# EAGLE board glassesBoard (EAGLE 9.2.2), part 1 of 2
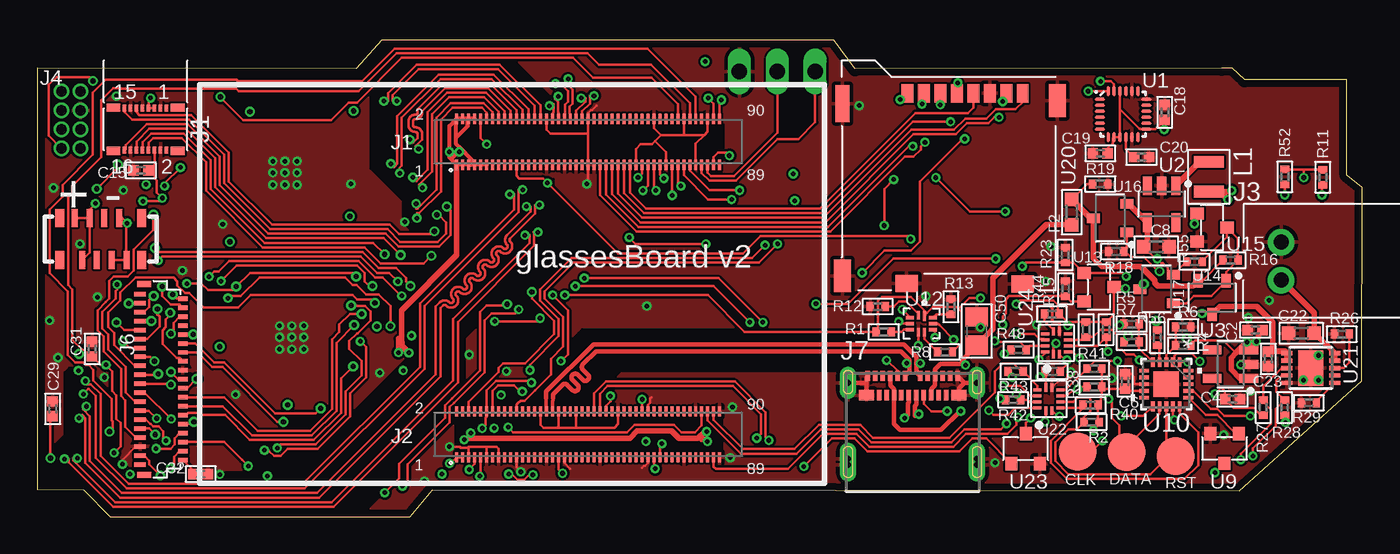
[diagram p2: board, top side]
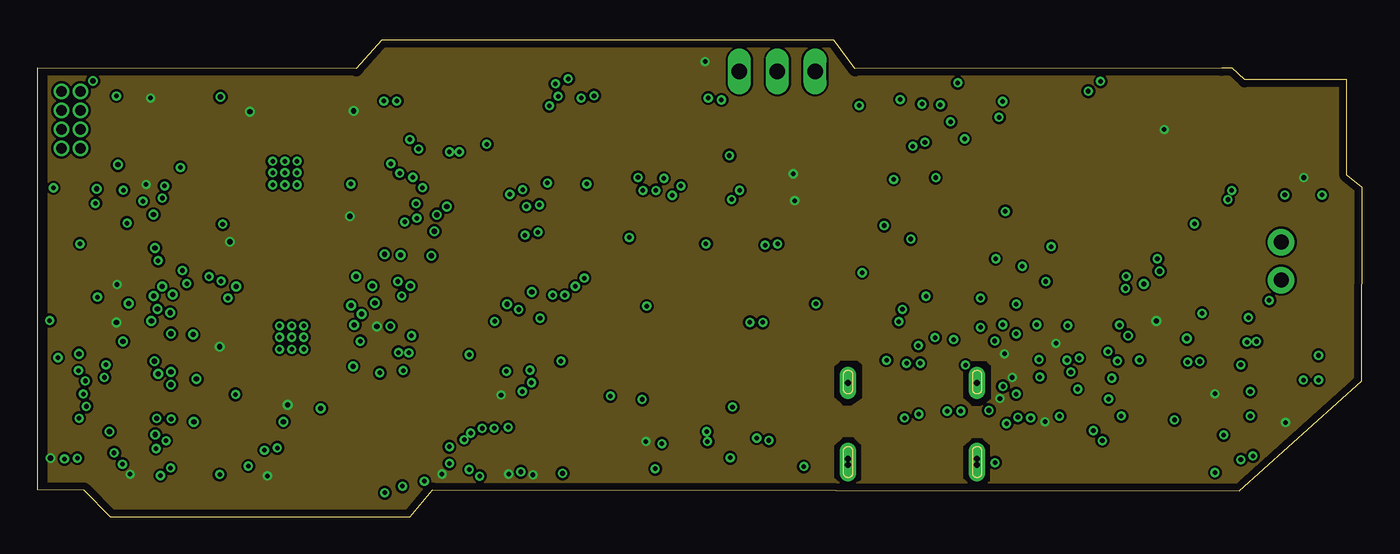
[diagram p3: board, inner layer Route2]
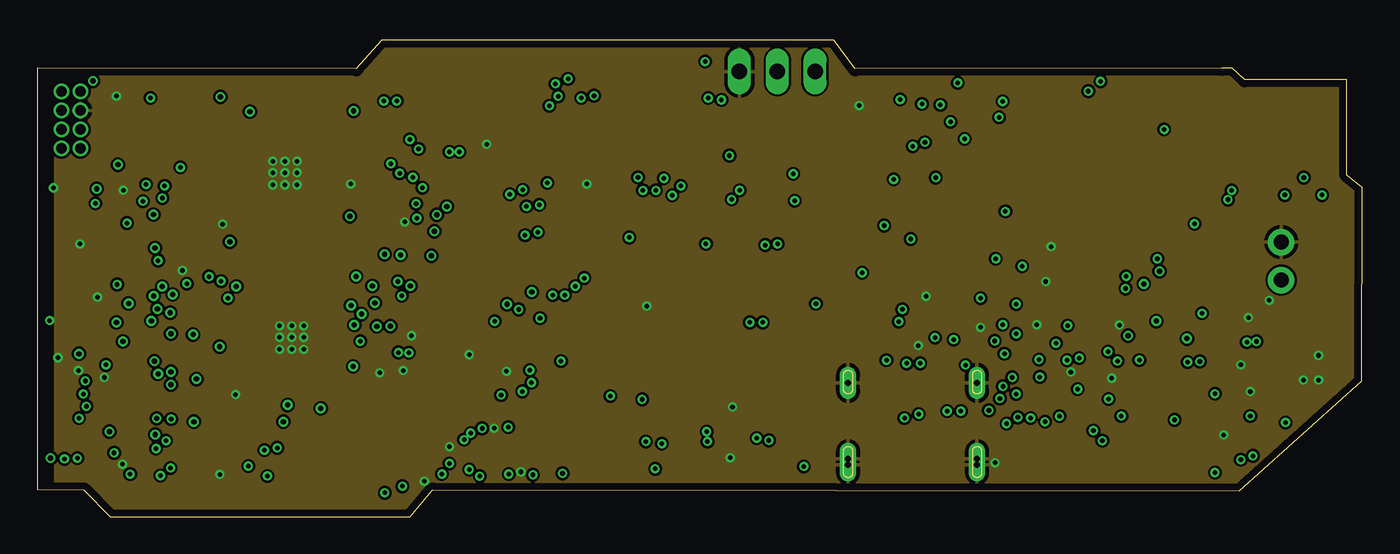
[diagram p4: board, inner layer Route15]
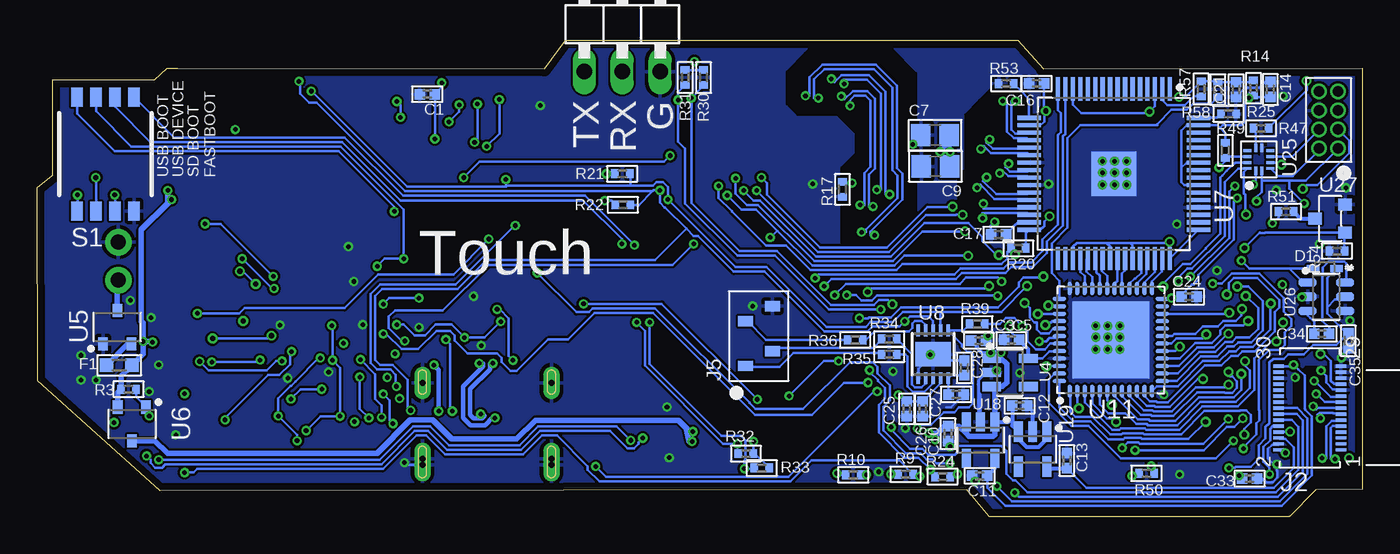
[diagram p5: board, bottom side, seen from below]

Size 88.71 x 31.93 mm. Coordinates in mm from the lower left corner, seen from the top.
Outline: 0,1.83 3.11,1.78 4.89,0 24.96,0 26.48,1.78 80.47,1.73 88.69,9.1 88.71,22.03 87.69,22.86 87.69,29.26 80.84,29.26 80.02,30.02 79.29,30.02 54.75,30 53.33,31.93 23.05,31.93 21.35,30 0,30.02 0,1.83
Copper layers (1*2*15*16): Top 0.035mm / dielectric 0.2mm / Route2 0.035mm / dielectric 1.2mm / Route15 0.035mm / dielectric 0.2mm / Bottom 0.035mm
Design rules "Elecrow_4-layer_PCB_eagle_rule": minimum track width 6mil, minimum drill 12mil, track to track 6mil, track to pad 6mil, pad to pad 6mil, via to via 8mil, smd to smd 0mil, copper to edge 20mil, drill to drill 10mil, minimum pad ring 6mil, minimum via ring 6mil, stop-mask expansion 0mil, vias tented up to drill 100mil, thermal gap 10mil
Net classes: 1 wide_diff_pair: width 0.127 mm, drill 0.305 mm, clearance 0.127 mm

## Footprints (pad centres in the part's own frame; a part is rotated, then mirrored left to right if it is on the bottom)
C0402 = smd 0.7 x 0.7: 1 -0.5,0; 2 0.5,0
C0805 = smd 1.3 x 1.5: 1 -0.95,0; 2 0.95,0
C0603 = smd 0.9 x 0.9: 1 -0.85,0; 2 0.85,0
SOD1608X70 = smd 0.86 x 0.46: A 0.785,0; C -0.785,0
R0603 = smd 0.9 x 0.9: 1 -0.85,0; 2 0.85,0
BM10NB(0.8)-16DS-0.4V(51) = smd 0.23 x 0.47: 1 -1.4,-1.405; 2 -1.4,1.405; 3 -1,-1.405; 4 -1,1.405; 5 -0.6,-1.405; 6 -0.6,1.405; 7 -0.2,-1.405; 8 -0.2,1.405; 9 0.2,-1.405; 10 0.2,1.405; 11 0.6,-1.405; 12 0.6,1.405; 13 1,-1.405; 14 1,1.405; 15 1.4,-1.405; 16 1.4,1.405 | smd 0.92 x 0.55: 17 -2.15,1.445; 18 2.15,1.445; 19 -2.15,-1.445; 20 2.15,-1.445
DF30FC-30DS-0.4V = smd 0.23 x 0.7: 1 2.8,2.08; 2 2.8,-2.08; 3 2.4,2.08; 4 2.4,-2.08; 5 2,2.08; 6 2,-2.08; 7 1.6,2.08; 8 1.6,-2.08; 9 1.2,2.08; 10 1.2,-2.08; 11 0.8,2.08; 12 0.8,-2.08; 13 0.4,2.08; 14 0.4,-2.08; 15 0,2.08; 16 0,-2.08; 17 -0.4,2.08; 18 -0.4,-2.08; 19 -0.8,2.08; 20 -0.8,-2.08; 21 -1.2,2.08; 22 -1.2,-2.08; 23 -1.6,2.08; 24 -1.6,-2.08; 25 -2,2.08; 26 -2,-2.08; 27 -2.4,2.08; 28 -2.4,-2.08; 29 -2.8,2.08; 30 -2.8,-2.08
S2B-XH-A(LF)(SN) = drill 1 pad 1.778: 1 0,1.27; 2 0,-1.27
GRPB042MWCN-RC = drill 0.7 pad 0.991: 1 -1.905,-0.635; 2 -0.635,-0.635; 3 0.635,-0.635; 4 1.905,-0.635; 5 1.905,0.635; 6 0.635,0.635; 7 -0.635,0.635; 8 -1.905,0.635
0787324001 = smd 0.7 x 1: 1 -2,0.9; 2 -1,-0.9; 3 1,0.9; 4 2,-0.9
FH26W-39S-0.3SHW = smd 0.3 x 0.8: 1 -5.7,0; 3 -5.1,0; 5 -4.5,0; 7 -3.9,0; 9 -3.3,0; 11 -2.7,0; 13 -2.1,0; 15 -1.5,0; 17 -0.9,0; 19 -0.3,0; 21 0.3,0; 23 0.9,0; 25 1.5,0; 27 2.1,0; 29 2.7,0; 31 3.3,0; 33 3.9,0; 35 4.5,0; 37 5.1,0; 39 5.7,0 | smd 0.3 x 0.65: 2 -5.4,2.875; 4 -4.8,2.875; 6 -4.2,2.875; 8 -3.6,2.875; 10 -3,2.875; 12 -2.4,2.875; 14 -1.8,2.875; 16 -1.2,2.875; 18 -0.6,2.875; 20 0,2.875; 22 0.6,2.875; 24 1.2,2.875; 26 1.8,2.875; 28 2.4,2.875; 30 3,2.875; 32 3.6,2.875; 34 4.2,2.875; 36 4.8,2.875; 38 5.4,2.875 | smd 0.4 x 0.95: P$21 -6.4,0.275; P$22 6.4,0.275
MOLEX_105450-0101 = smd 0.3 x 0.7: A1 -3,3.77; A2 -2.5,3.77; A3 -2,3.77; A4 -1.5,3.77; A5 -1,3.77; A6 -0.5,3.77; A7 0.5,3.77; A8 1,3.77; A9 1.5,3.77; A10 2,3.77; A11 2.5,3.77; A12 3,3.77; B2 2.25,2.47; B3 1.75,2.47; B4 1.25,2.47; B5 0.75,2.47; B6 0.25,2.47; B7 -0.25,2.47; B8 -0.75,2.47; B9 -1.25,2.47; B10 -1.75,2.47; B11 -2.25,2.47 | smd 1 x 0.7: B1 3.1,2.47; B12 -3.1,2.47 | drill 0.4 pad 1.1 long: P$1 -4.32,3.3; P$2 -4.32,-2.2; P$3 -4.32,-1.8; P$4 4.32,3.3; P$5 4.32,-2.2; P$6 4.32,-1.8
62674-081121ALF = smd 0.4 x 1.2: 1 2.5,-1.4; 2 2,1.4; 3 1.5,-1.4; 4 1,1.4; 5 0.5,-1.4; 6 0,1.4; 7 -0.5,-1.4; 8 -1,1.4 | smd 0.6 x 1.2: P$9 -2,1.4; P$10 -2,-1.4; P$11 3.5,-1.4; P$12 3.5,1.4
1X03/90 = drill 1.016 long: 1 -2.54,-3.81; 2 0,-3.81; 3 2.54,-3.81
1008 = smd 0.8 x 2: P$1 -1,0; P$2 1,0
R0402 = smd 0.5 x 0.6: 1 -0.5,0; 2 0.5,0
218-4LPST = smd 0.76 x 1.27: 1 -1.905,-3.81; 2 -1.905,3.81; 3 -0.635,-3.81; 4 -0.635,3.81; 5 0.635,-3.81; 6 0.635,3.81; 7 1.905,-3.81; 8 1.905,3.81
B2,54 = smd 2.54 x 2.54: TP 0,0
QFN40P300X300X105-25N = smd 0.7 x 0.2: 1 -1.55,1; 2 -1.55,0.6; 3 -1.55,0.2; 4 -1.55,-0.2; 5 -1.55,-0.6; 6 -1.55,-1; 13 1.55,-1; 14 1.55,-0.6; 15 1.55,-0.2; 16 1.55,0.2; 17 1.55,0.6; 18 1.55,1 | smd 0.2 x 0.7: 7 -1,-1.55; 8 -0.6,-1.55; 9 -0.2,-1.55; 10 0.2,-1.55; 11 0.6,-1.55; 12 1,-1.55; 19 1,1.55; 20 0.6,1.55; 21 0.2,1.55; 22 -0.2,1.55; 23 -0.6,1.55; 24 -1,1.55
SOT23-5 = smd 1.259 x 0.609: 1 -1.228,0.95; 2 -1.228,0; 3 -1.228,-0.95; 4 1.228,-0.95; 5 1.228,0.95
SOTFL95P240X80-3 = smd 0.878 x 0.641: 1 -1.125,0.95; 2 -1.125,-0.95; 3 1.125,0
QFP50P1200X1200X120-65T300 = smd 1.559 x 0.28: 1 -5.678,3.75; 2 -5.678,3.25; 3 -5.678,2.75; 4 -5.678,2.25; 5 -5.678,1.75; 6 -5.678,1.25; 7 -5.678,0.75; 8 -5.678,0.25; 9 -5.678,-0.25; 10 -5.678,-0.75; 11 -5.678,-1.25; 12 -5.678,-1.75; 13 -5.678,-2.25; 14 -5.678,-2.75; 15 -5.678,-3.25; 16 -5.678,-3.75; 33 5.678,-3.75; 34 5.678,-3.25; 35 5.678,-2.75; 36 5.678,-2.25; 37 5.678,-1.75; 38 5.678,-1.25; 39 5.678,-0.75; 40 5.678,-0.25; 41 5.678,0.25; 42 5.678,0.75; 43 5.678,1.25; 44 5.678,1.75; 45 5.678,2.25; 46 5.678,2.75; 47 5.678,3.25; 48 5.678,3.75 | smd 0.28 x 1.559: 17 -3.75,-5.678; 18 -3.25,-5.678; 19 -2.75,-5.678; 20 -2.25,-5.678; 21 -1.75,-5.678; 22 -1.25,-5.678; 23 -0.75,-5.678; 24 -0.25,-5.678; 25 0.25,-5.678; 26 0.75,-5.678; 27 1.25,-5.678; 28 1.75,-5.678; 29 2.25,-5.678; 30 2.75,-5.678; 31 3.25,-5.678; 32 3.75,-5.678; 49 3.75,5.678; 50 3.25,5.678; 51 2.75,5.678; 52 2.25,5.678; 53 1.75,5.678; 54 1.25,5.678; 55 0.75,5.678; 56 0.25,5.678; 57 -0.25,5.678; 58 -0.75,5.678; 59 -1.25,5.678; 60 -1.75,5.678; 61 -2.25,5.678; 62 -2.75,5.678; 63 -3.25,5.678; 64 -3.75,5.678 | smd 3 x 3: 65 0,0
DFN10-3X3 = smd 0.8 x 0.3: 1 -1.6,1; 2 -1.6,0.5; 3 -1.6,0; 4 -1.6,-0.5; 5 -1.6,-1; 6 1.6,-1; 7 1.6,-0.5; 8 1.6,0; 9 1.6,0.5; 10 1.6,1 | smd 1.65 x 2.38: EXP 0,0
SOT-23_(TO-236AB) = smd 0.8 x 0.9: D 0,-1; G 0.95,1; S -0.95,1
20M2 = smd 0.66 x 0.254: 1 -1.477,0.9; 2 -1.477,0.45; 3 -1.477,0; 4 -1.477,-0.45; 5 -1.477,-0.9; 11 1.477,-0.9; 12 1.477,-0.45; 13 1.477,0; 14 1.477,0.45; 15 1.477,0.9 | smd 0.254 x 0.66: 6 -0.9,-1.477; 7 -0.45,-1.477; 8 0,-1.477; 9 0.45,-1.477; 10 0.9,-1.477; 16 0.9,1.477; 17 0.45,1.477; 18 0,1.477; 19 -0.45,1.477; 20 -0.9,1.477 | smd 1.7 x 1.7: 21 0,0
QFN50P700X700X100-49T515 = smd 0.896 x 0.27: 1 -3.437,2.75; 2 -3.437,2.25; 3 -3.437,1.75; 4 -3.437,1.25; 5 -3.437,0.75; 6 -3.437,0.25; 7 -3.437,-0.25; 8 -3.437,-0.75; 9 -3.437,-1.25; 10 -3.437,-1.75; 11 -3.437,-2.25; 12 -3.437,-2.75; 25 3.437,-2.75; 26 3.437,-2.25; 27 3.437,-1.75; 28 3.437,-1.25; 29 3.437,-0.75; 30 3.437,-0.25; 31 3.437,0.25; 32 3.437,0.75; 33 3.437,1.25; 34 3.437,1.75; 35 3.437,2.25; 36 3.437,2.75 | smd 0.27 x 0.896: 13 -2.75,-3.437; 14 -2.25,-3.437; 15 -1.75,-3.437; 16 -1.25,-3.437; 17 -0.75,-3.437; 18 -0.25,-3.437; 19 0.25,-3.437; 20 0.75,-3.437; 21 1.25,-3.437; 22 1.75,-3.437; 23 2.25,-3.437; 24 2.75,-3.437; 37 2.75,3.437; 38 2.25,3.437; 39 1.75,3.437; 40 1.25,3.437; 41 0.75,3.437; 42 0.25,3.437; 43 -0.25,3.437; 44 -0.75,3.437; 45 -1.25,3.437; 46 -1.75,3.437; 47 -2.25,3.437; 48 -2.75,3.437 | smd 5.15 x 5.15: 49 0,0
UQFN10 = smd 0.663 x 0.225: 1 -0.518,0.2 | smd 0.563 x 0.225: 2 -0.569,-0.2; 6 0.569,-0.2; 7 0.569,0.2 | smd 0.225 x 0.563: 3 -0.4,-0.768; 4 0,-0.768; 5 0.4,-0.768; 8 0.4,0.768; 9 0,0.768; 10 -0.4,0.768
SOT95P275X130-5 = smd 1.38 x 0.589: 1 -1.166,0.95; 2 -1.166,0; 3 -1.166,-0.95; 4 1.166,-0.95; 5 1.166,0.95
MICROSD = smd 0.8 x 1.24: 1 -4.4,0; 2 -3.3,0; 3 -2.2,0; 4 -1.1,0; 5 0,0; 6 1.1,0; 7 2.2,0; 8 3.3,0 | smd 0.95 x 2.5: 9 -8.775,-0.7 | smd 1.15 x 2.2: 10 5.615,-0.5; 11 -8.775,-12.23 | smd 1.5 x 1.15: 12 -4.47,-12.755; 13 3.31,-12.775
12MLP = smd 0.563 x 0.2: 1 -0.768,0.2; 2 -0.768,-0.2; 7 0.768,-0.2; 8 0.768,0.2 | smd 0.2 x 0.563: 3 -0.6,-0.768; 4 -0.2,-0.768; 5 0.2,-0.768; 6 0.6,-0.768; 9 0.6,0.768; 10 0.2,0.768; 11 -0.2,0.768; 12 -0.6,0.768
SOT95P280X145-6 = smd 1.209 x 0.584: 1 -1.253,0.95; 2 -1.253,0; 3 -1.253,-0.95; 4 1.253,-0.95; 5 1.253,0; 6 1.253,0.95
DART-SD410 = smd 0.2 x 0.7: J1.1 8.8,-18.02; J1.2 8.8,-21.1; J1.3 8.4,-18.02; J1.4 8.4,-21.1; J1.5 8,-18.02; J1.6 8,-21.1; J1.7 7.6,-18.02; J1.8 7.6,-21.1; J1.9 7.2,-18.02; J1.10 7.2,-21.1; J1.11 6.8,-18.02; J1.12 6.8,-21.1; J1.13 6.4,-18.02; J1.14 6.4,-21.1; J1.15 6,-18.02; J1.16 6,-21.1; J1.17 5.6,-18.02; J1.18 5.6,-21.1; J1.19 5.2,-18.02; J1.20 5.2,-21.1; J1.21 4.8,-18.02; J1.22 4.8,-21.1; J1.23 4.4,-18.02; J1.24 4.4,-21.1; J1.25 4,-18.02; J1.26 4,-21.1; J1.27 3.6,-18.02; J1.28 3.6,-21.1; J1.29 3.2,-18.02; J1.30 3.2,-21.1; J1.31 2.8,-18.02; J1.32 2.8,-21.1; J1.33 2.4,-18.02; J1.34 2.4,-21.1; J1.35 2,-18.02; J1.36 2,-21.1; J1.37 1.6,-18.02; J1.38 1.6,-21.1; J1.39 1.2,-18.02; J1.40 1.2,-21.1; J1.41 0.8,-18.02; J1.42 0.8,-21.1; J1.43 0.4,-18.02; J1.44 0.4,-21.1; J1.45 0,-18.02; J1.46 0,-21.1; J1.47 -0.4,-18.02; J1.48 -0.4,-21.1; J1.49 -0.8,-18.02; J1.50 -0.8,-21.1; J1.51 -1.2,-18.02; J1.52 -1.2,-21.1; J1.53 -1.6,-18.02; J1.54 -1.6,-21.1; J1.55 -2,-18.02; J1.56 -2,-21.1; J1.57 -2.4,-18.02; J1.58 -2.4,-21.1; J1.59 -2.8,-18.02; J1.60 -2.8,-21.1; J1.61 -3.2,-18.02; J1.62 -3.2,-21.1; J1.63 -3.6,-18.02; J1.64 -3.6,-21.1; J1.65 -4,-18.02; J1.66 -4,-21.1; J1.67 -4.4,-18.02; J1.68 -4.4,-21.1; J1.69 -4.8,-18.02; J1.70 -4.8,-21.1; J1.71 -5.2,-18.02; J1.72 -5.2,-21.1; J1.73 -5.6,-18.02; J1.74 -5.6,-21.1; J1.75 -6,-18.02; J1.76 -6,-21.1; J1.77 -6.4,-18.02; J1.78 -6.4,-21.1; J1.79 -6.8,-18.02; J1.80 -6.8,-21.1; J1.81 -7.2,-18.02; J1.82 -7.2,-21.1; J1.83 -7.6,-18.02; J1.84 -7.6,-21.1; J1.85 -8,-18.02; J1.86 -8,-21.1; J1.87 -8.4,-18.02; J1.88 -8.4,-21.1; J1.89 -8.8,-18.02; J1.90 -8.8,-21.1; J2.1 8.8,1.58; J2.2 8.8,-1.5; J2.3 8.4,1.58; J2.4 8.4,-1.5; J2.5 8,1.58; J2.6 8,-1.5; J2.7 7.6,1.58; J2.8 7.6,-1.5; J2.9 7.2,1.58; J2.10 7.2,-1.5; J2.11 6.8,1.58; J2.12 6.8,-1.5; J2.13 6.4,1.58; J2.14 6.4,-1.5; J2.15 6,1.58; J2.16 6,-1.5; J2.17 5.6,1.58; J2.18 5.6,-1.5; J2.19 5.2,1.58; J2.20 5.2,-1.5; J2.21 4.8,1.58; J2.22 4.8,-1.5; J2.23 4.4,1.58; J2.24 4.4,-1.5; J2.25 4,1.58; J2.26 4,-1.5; J2.27 3.6,1.58; J2.28 3.6,-1.5; J2.29 3.2,1.58; J2.30 3.2,-1.5; J2.31 2.8,1.58; J2.32 2.8,-1.5; J2.33 2.4,1.58; J2.34 2.4,-1.5; J2.35 2,1.58; J2.36 2,-1.5; J2.37 1.6,1.58; J2.38 1.6,-1.5; J2.39 1.2,1.58; J2.40 1.2,-1.5; J2.41 0.8,1.58; J2.42 0.8,-1.5; J2.43 0.4,1.58; J2.44 0.4,-1.5; J2.45 0,1.58; J2.46 0,-1.5; J2.47 -0.4,1.58; J2.48 -0.4,-1.5; J2.49 -0.8,1.58; J2.50 -0.8,-1.5; J2.51 -1.2,1.58; J2.52 -1.2,-1.5; J2.53 -1.6,1.58; J2.54 -1.6,-1.5; J2.55 -2,1.58; J2.56 -2,-1.5; J2.57 -2.4,1.58; J2.58 -2.4,-1.5; J2.59 -2.8,1.58; J2.60 -2.8,-1.5; J2.61 -3.2,1.58; J2.62 -3.2,-1.5; J2.63 -3.6,1.58; J2.64 -3.6,-1.5; J2.65 -4,1.58; J2.66 -4,-1.5; J2.67 -4.4,1.58; J2.68 -4.4,-1.5; J2.69 -4.8,1.58; J2.70 -4.8,-1.5; J2.71 -5.2,1.58; J2.72 -5.2,-1.5; J2.73 -5.6,1.58; J2.74 -5.6,-1.5; J2.75 -6,1.58; J2.76 -6,-1.5; J2.77 -6.4,1.58; J2.78 -6.4,-1.5; J2.79 -6.8,1.58; J2.80 -6.8,-1.5; J2.81 -7.2,1.58; J2.82 -7.2,-1.5; J2.83 -7.6,1.58; J2.84 -7.6,-1.5; J2.85 -8,1.58; J2.86 -8,-1.5; J2.87 -8.4,1.58; J2.88 -8.4,-1.5; J2.89 -8.8,1.58; J2.90 -8.8,-1.5

## Placement (x,y rotation side)
C1  1uF  [C0402]  62.6,28.3 180 bottom
C2  1uF  [C0402]  81.55,12.5 180 top
C3  1uF  [C0402]  25.67,11.79 0 bottom
C4  1uF  [C0402]  80.02,7.87 0 top
C5  1uF  [C0402]  23.48,11.84 180 bottom
C6  1uF  [C0402]  72.84,9.05 90 top
C7  22uF  [C0805]  28.6,25.55 0 bottom
C8  10uF  [C0603]  74.92,18.07 0 top
C9  22uF  [C0805]  28.58,23.46 180 bottom
C10  1uF  [C0402]  27.73,5.55 270 bottom
C11  1uF  [C0402]  25.6,2.73 180 bottom
C12  1uF  [C0402]  22.94,7.42 0 bottom
C13  1uF  [C0402]  19.77,3.75 90 bottom
C14  1uF  [C0402]  6.15,28.61 90 bottom
C15  1uF  [C0402]  6.93,23.19 0 top
C16  1uF  [C0402]  21.81,29.01 180 bottom
C17  1uF  [C0402]  24.35,18.9 180 bottom
C18  100nF  [C0402]  75.49,27.08 90 top
C19  100nF  [C0402]  71.18,24.33 180 top
C20  100nF  [C0402]  73.93,24.08 0 top
C21  1uF  [C0402]  8.45,28.6 270 bottom
C22  10uF  [C0603]  84.64,12.28 180 top
C23  1uF  [C0402]  82.42,10.56 270 top
C24  1uF  [C0402]  11.6,14.73 0 bottom
C25  1uF  [C0402]  30.49,7.21 270 bottom
C26  100nF  [C0402]  29.43,7.21 270 bottom
C27  1uF  [C0402]  27.19,8.18 0 bottom
C28  100nF  [C0402]  26.63,9.96 90 bottom
C29  1uF  [C0402]  1.03,7.21 90 top
C31  1uF  [C0402]  3.67,11.23 90 top
C32  100nF  [C0402]  10.94,2.84 0 top
C33  100nF  [C0402]  7.53,2.54 0 bottom
C34  1uF  [C0402]  2.71,12.24 180 bottom
C35  1uF  [C0402]  0.93,11.79 270 bottom
C50  22uF  [C0805]  62.9,12.42 90 top
D1  SDM03U40-7SC79  [SOD1608X70]  2.5,16.61 180 bottom
F1  SF-0603S200-2  [R0603]  83.22,10.14 0 bottom
F2  SF-0603S200-2  [R0603]  69.26,20.4 90 top
J1  BM10NB(0.8)-16DS-0.4V(51)  [BM10NB(0.8)-16DS-0.4V(51)]  7.25,25.95 180 top
J2  DF30FC-30DS-0.4V  [DF30FC-30DS-0.4V]  3.51,7.27 270 bottom
J3  S2B-XH-A(LF)(SN)  [S2B-XH-A(LF)(SN)]  83.29,17.11 180 top
J4  GRPB042MWCN-RC  [GRPB042MWCN-RC]  2.25,26.57 90 bottom
J5  0787324001  [0787324001]  40.4,12.09 90 bottom
J6  FH26W-39S-0.3SHW  [FH26W-39S-0.3SHW]  6.87,9.19 270 top
J7  105450-0101  [MOLEX_105450-0101]  58.61,5.65 0 top
J8  62674-081121ALF  [62674-081121ALF]  4.99,18.59 180 top
JP1  [1X03/90]  49.54,33.63 0 bottom
L1  4.7uH  [1008]  78.44,22.76 270 top
R1  56k  [R0402]  56.68,12.37 180 top
R2  10k  [R0402]  70.58,6.33 180 top
R3  10k  [R0402]  82.6,8.53 0 bottom
R4  2.15k  [R0402]  76.73,11.47 0 top
R5  1k  [R0402]  73.26,12.9 180 top
R6  3.2k  [R0402]  76.73,12.7 0 top
R7  3.2k  [R0402]  73.27,11.69 0 top
R8  56k  [R0402]  60.77,11.02 0 top
R9  10k  [R0402]  30.57,2.84 180 bottom
R10  10k  [R0402]  34.07,2.79 0 bottom
R11  10k  [R0402]  86.07,22.73 90 top
R12  5.1k  [R0402]  56.27,14.06 0 top
R13  5.1k  [R0402]  61.17,14.05 270 top
R14  10k  [R0402]  7.28,28.7 90 bottom
R15  10k  [R0402]  68.85,15.26 270 top
R16  10k  [R0402]  79.89,17.17 180 top
R17  10k  [R0402]  34.8,21.92 90 bottom
R18  10k  [R0402]  72.24,17.76 0 top
R19  10k  [R0402]  71.17,22.28 0 top
R20  10k  [R0402]  23.02,17.97 0 bottom
R21  5.1k  [R0402]  49.55,22.96 180 bottom
R22  5.1k  [R0402]  49.5,20.88 180 bottom
R23  10k  [R0402]  68.82,17.52 270 top
R24  10k  [R0402]  28.1,2.68 0 bottom
R25  10k  [R0402]  8.95,26.97 180 bottom
R26  10k  [R0402]  87.35,12.22 0 top
R27  10k  [R0402]  82.08,7.31 270 top
R28  10k  [R0402]  83.52,7.31 270 top
R29  2k  [R0402]  85.14,7.62 0 top
R30  5.1k  [R0402]  44.11,29.41 90 bottom
R31  5.1k  [R0402]  45.33,29.41 90 bottom
R32  5.1k  [R0402]  41.26,4.22 0 bottom
R33  5.1k  [R0402]  40.2,3.25 0 bottom
R34  470R  [R0402]  31.66,11.89 180 bottom
R35  470R  [R0402]  31.66,10.87 180 bottom
R36  470R  [R0402]  33.95,11.84 180 bottom
R37  10k  [R0402]  67.98,9.73 0 top
R38  5.1k  [R0402]  70.78,8.69 0 top
R39  5.1k  [R0402]  25.77,12.9 0 bottom
R40  5.1k  [R0402]  70.52,7.47 0 top
R41  10k  [R0402]  70.78,9.91 0 top
R42  10k  [R0402]  65.34,7.82 180 top
R43  10k  [R0402]  65.49,9.73 180 top
R44  10k  [R0402]  67.93,13.56 0 top
R45  10k  [R0402]  70.22,12.52 90 top
R46  10k  [R0402]  71.56,12.52 90 top
R47  10k  [R0402]  6.77,26.01 0 bottom
R48  10k  [R0402]  65.7,11.18 180 top
R49  10k  [R0402]  9.16,24.54 90 bottom
R50  10k  [R0402]  14.44,2.9 180 bottom
R51  8R  [R0402]  5.09,20.42 180 bottom
R52  10k  [R0402]  83.53,22.76 90 top
R53  10k  [R0402]  23.84,29.01 0 bottom
R54  10k  [R0402]  1.69,17.78 0 bottom
R55  10k  [R0402]  77.48,17.07 180 top
R56  10k  [R0402]  74.99,11.99 90 top
R57  0R  [R0402]  10.78,28.65 270 bottom
R58  0R  [R0402]  9.67,28.6 270 bottom
S1  218-4LPST  [218-4LPST]  84.14,24.28 0 bottom
TP1  TPB2,54  [B2,54]  69.67,4.34 0 top
TP2  TPB2,54  [B2,54]  72.92,4.32 0 top
TP3  TPB2,54  [B2,54]  76.22,4.05 0 top
U1  [QFN40P300X300X105-25N]  72.7,26.95 0 top
U2  TPS613222A  [SOT23-5]  75.28,20.93 270 top
U3  1.8  [SOT23-5]  79.88,10.2 180 top
U4  3.3  [SOT23-5]  23.58,9.65 0 bottom
U5  SSM3J338RSOT-23F  [SOTFL95P240X80-3]  83.36,12.69 90 bottom
U6  SSM3J338RSOT-23F  [SOTFL95P240X80-3]  82.38,6.2 270 bottom
U7  SN65DSI83-Q1S-PQFP-G64  [QFP50P1200X1200X120-65T300]  16.62,22.96 270 bottom
U8  IQS263BDFN10  [DFN10-3X3]  28.73,10.88 90 bottom
U9  NX3020NAK  [SOT-23_(TO-236AB)]  79.49,4.57 0 top
U10  ATTINY20-MMH  [20M2]  75.59,8.87 270 top
U11  SN65LVDS822VQFN48  [QFN50P700X700X100-49T515]  16.83,11.84 90 bottom
U12  NLAS2750  [UQFN10]  59.2,12.93 270 top
U13  NX3020NAK  [SOT-23_(TO-236AB)]  71.09,15.37 90 top
U14  SSM3J338RSOT-23F  [SOTFL95P240X80-3]  78.66,14.67 270 top
U15  NX3020NAK  [SOT-23_(TO-236AB)]  78.66,19.36 90 top
U16  SSM3J338RSOT-23F  [SOTFL95P240X80-3]  71.83,19.99 180 top
U17  SSM3J338RSOT-23F  [SOTFL95P240X80-3]  74.94,15.24 180 top
U18  2.8  [SOT23-5]  25.55,5.12 270 bottom
U19  TCR2EF15SOT-25  [SOT95P275X130-5]  22.06,4.51 270 bottom
U20  MICROSD  [MICROSD]  62.67,28.36 0 top
U21  MCP73833  [DFN10-3X3]  85.26,9.95 0 top
U22  FXMA2104UMX  [12MLP]  67.73,7.87 90 top
U23  NX3020NAK  [SOT-23_(TO-236AB)]  66.18,4.55 180 top
U24  FXMA2104UMX  [12MLP]  68.24,11.63 90 top
U25  FXMA2104UMX  [12MLP]  6.92,23.93 90 bottom
U26  LM2665M6XSOT23-6  [SOT95P280X145-6]  2.4,14.73 0 bottom
U27  NX3020NAK  [SOT-23_(TO-236AB)]  2.15,19.96 270 bottom
U$1  DART-SD410  [DART-SD410]  36.89,5.55 180 top